# Altium schematic sheet MPU-GPS.SchDoc
size A; SheetNumber: 4; SheetTotal: 4
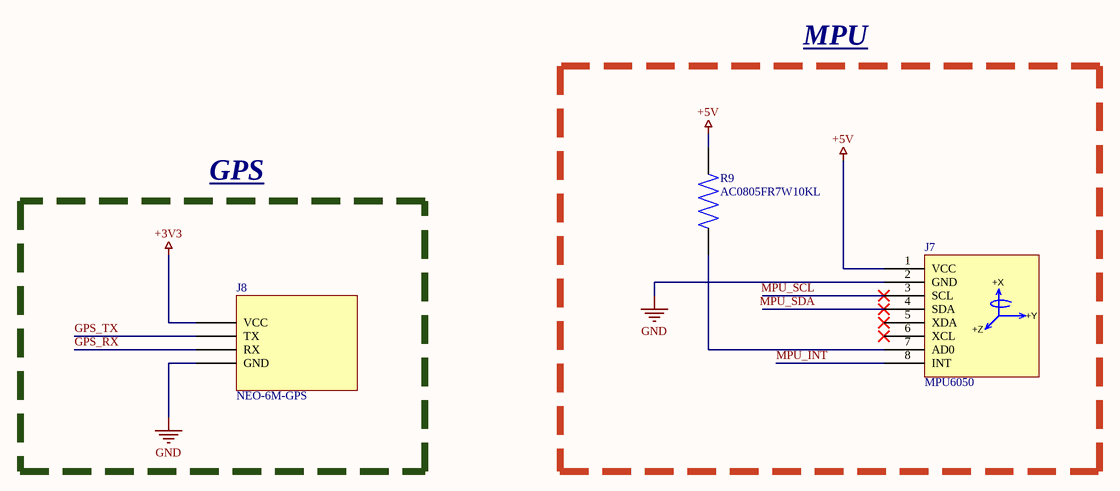
[diagram p0: MPU-GPS.SchDoc]

## Parts
J7  MPU6050  [MPU6050]
J8  NEO-6M-GPS  [NEO-6M-GPS]
R9  AC0805FR7W10KL  [RESC2012X60N]

## Blocks framed on the sheet
MPU: J7 R9
GPS: J8

## Nets
+3V3: J8.3(VCC)
+5V: J7.1(VCC) R9.1
GND: J7.2(GND) J8.0(GND)
GPS_RX: J8.2(RX)
GPS_TX: J8.1(TX)
MPU_INT: J7.8(INT)
MPU_SCL: J7.3(SCL)
MPU_SDA: J7.4(SDA)
NetJ7_7: J7.7(AD0) R9.2

Not connected (* = marked no-connect by the designer): J7 5(XDA)* 6(XCL)*

## Notes on the sheet
- (in symbol MPU6050) +X; +Y; +Z

## Library data of the parts
J8 = NEO-6M-GPS: Manufacturer: u-blox; Voltage - Supply: 2.7V ~ 3.6V; Modulation or Protocol: GPS; Data Interface: I2C
R9 = AC0805FR7W10KL: RES SMD 18 OHM 5% 1/8W 0805; MF: {'manufacturer': u'Yageo Corporation'}; Package: None; Price: None; Value: *; MP: AC0805FR7W10KL; Availability: Unavailable